# Altium schematic sheet IR.SchDoc
size A4
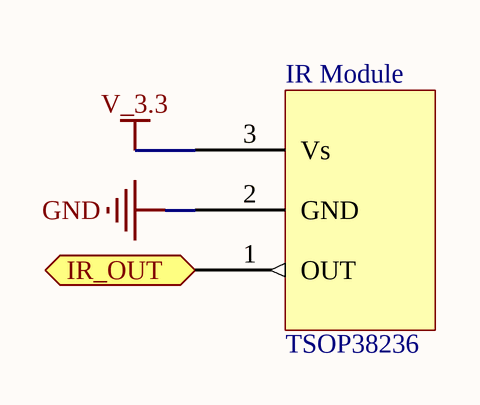
[diagram p0: IR.SchDoc]

## Parts
IR_Module  TSOP38236  [TSOP38236 IR Receiver]

## Ports
IR_OUT (out)

## Nets
GND: IR_Module.2(GND)
V_3.3: IR_Module.3(Vs)
IR_OUT: IR_Module.1(OUT) ; port IR_OUT